# Altium project AD9850模块.PrjPcb
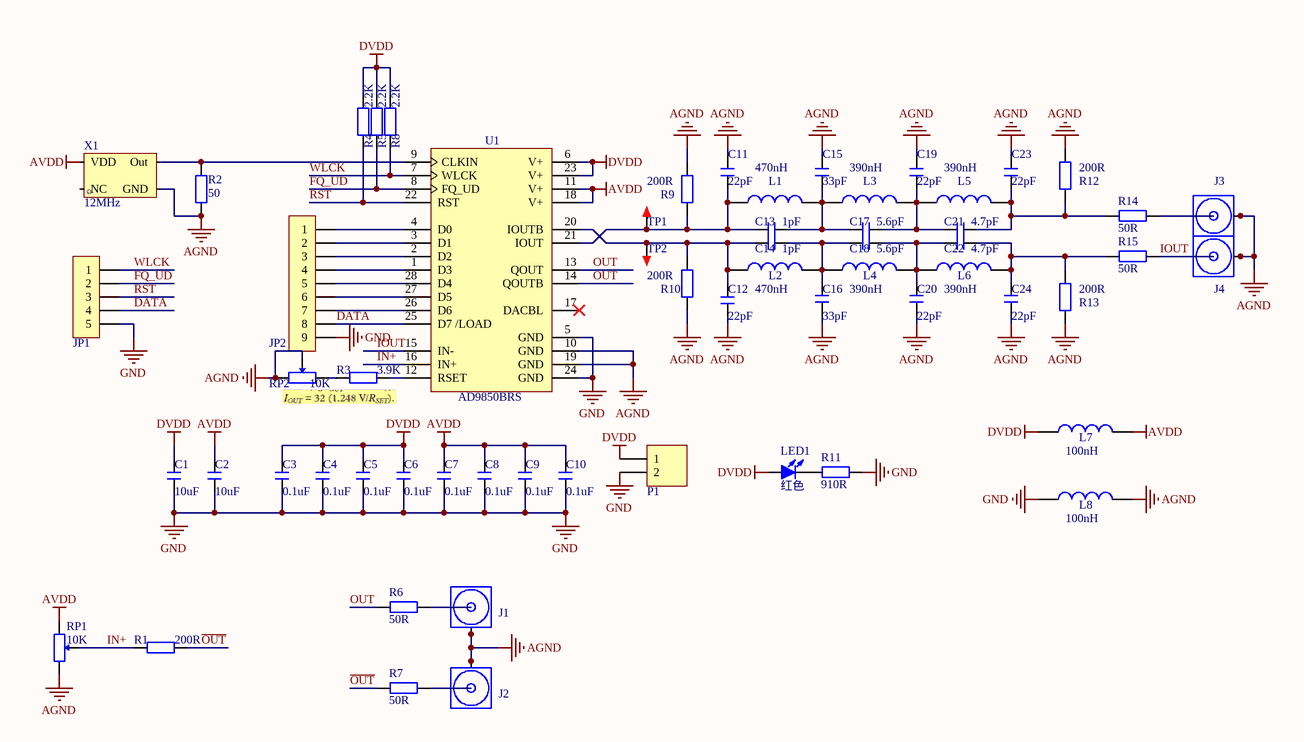
[diagram p0: AD9850模块.SchDoc]
1 sheet, 61 parts. Net scope: global (net labels, ports and power ports of the same name join across sheets).
Board file: AD9850模块.PcbDoc

## Sheet AD9850模块.SchDoc
size A4

### Parts
C1  10uF  [C 0805]
C2  10uF  [C 0805]
C3  0.1uF  [C 0805]
C4  0.1uF  [C 0805]
C5  0.1uF  [C 0805]
C6  0.1uF  [C 0805]
C7  0.1uF  [C 0805]
C8  0.1uF  [C 0805]
C9  0.1uF  [C 0805]
C10  0.1uF  [C 0805]
C11  22pF  [C 0603]
C12  22pF  [C 0603]
C13  1pF  [C 0603]
C14  1pF  [C 0603]
C15  33pF  [C 0603]
C16  33pF  [C 0603]
C17  5.6pF  [C 0603]
C18  5.6pF  [C 0603]
C19  22pF  [C 0603]
C20  22pF  [C 0603]
C21  4.7pF  [C 0603]
C22  4.7pF  [C 0603]
C23  22pF  [C 0603]
C24  22pF  [C 0603]
J1  COAX  [MCX5.08-5-H]  (value not drawn)
J2  COAX  [MCX5.08-5-H]  (value not drawn)
J3  COAX  [MCX5.08-5-H]  (value not drawn)
J4  COAX  [MCX5.08-5-H]  (value not drawn)
JP1  HDR-1X5  [HDR-1X5_H]  (value not drawn)
JP2  HDR-1X9  [HDR-1X9_H]  (value not drawn)
L1  470nH  [L 0603]
L2  470nH  [L 0603]
L3  390nH  [L 0603]
L4  390nH  [L 0603]
L5  390nH  [L 0603]
L6  390nH  [L 0603]
L7  100nH  [L 0603]
L8  100nH  [L 0603]
LED1  红色  [LED 0805G]
P1  Header 2  [HDR2X1_B2]  (value not drawn)
R1  200R  [R 0603]
R2  50  [R 0603]
R3  3.9K  [R 0603]
R4  2.2K  [R 0805]
R5  2.2K  [R 0805]
R6  50R  [R 0603]
R7  50R  [R 0603]
R8  2.2K  [R 0805]
R9  200R  [R 0603]
R10  200R  [R 0603]
R11  910R  [R 0805]
R12  200R  [R 0603]
R13  200R  [R 0603]
R14  50R  [R 0603]
R15  50R  [R 0603]
RP1  10K  [3296W]
RP2  10K  [3296W]
TP1  TEST TP  [TEST TP1.4_B]  (value not drawn)
TP2  TEST TP  [TEST TP1.4_B]  (value not drawn)
U1  AD9850BRS  [RS-28]
X1  Frequency: 12MHz  [X-CPX75]  (hidden comment: XTAL)

### Nets
AGND: C11.2 C12.2 C15.2 C16.2 C19.2 C20.2 C23.2 C24.2 J1.2(GND) J1.3(GND) J1.4(GND) J1.5(GND) J2.2(GND) J2.3(GND) J2.4(GND) J2.5(GND) J3.2(GND) J3.3(GND) J3.4(GND) J3.5(GND) J4.2(GND) J4.3(GND) J4.4(GND) J4.5(GND) L8.2 R2.1 R9.2 R10.1 R12.2 R13.1 RP1.3 RP2.1 RP2.2 U1.10(GND) U1.19(GND) X1.2(GND)
AVDD: C2.2 C7.2 C8.2 C9.2 C10.2 L7.2 RP1.1 U1.11(V+) U1.18(V+) X1.4(VDD)
DVDD: C1.2 C3.2 C4.2 C5.2 C6.2 L7.1 LED1.1(A) P1.1 R4.2 R5.2 R8.2 U1.6(V+) U1.23(V+)
GND: C1.1 C2.1 C3.1 C4.1 C5.1 C6.1 C7.1 C8.1 C9.1 C10.1 JP1.5 JP2.9 L8.1 P1.2 R11.1 U1.5(GND) U1.24(GND)
DATA: JP1.4 JP2.8 U1.25(D7_/LOAD)
FQ_UD: JP1.2 R5.1 U1.8(FQ_UD)
IN+: R1.2 RP1.2 U1.16(IN+)
IOUT: J4.1(Signal) R15.1 U1.15(IN-)
~{OUT}: R1.1 R7.2 U1.14(QOUTB)
OUT: R6.2 U1.13(QOUT)
RST: JP1.3 R4.1 U1.22(RST)
WLCK: JP1.1 R8.1 U1.7(WLCK)
NetC11_1: C11.1 C13.1 L1.1 R9.1 TP1.1 U1.21(IOUT)
NetC12_1: C12.1 C14.2 L2.1 R10.2 TP2.1 U1.20(IOUTB)
NetC13_2: C13.2 C15.1 C17.1 L1.2 L3.1
NetC14_1: C14.1 C16.1 C18.2 L2.2 L4.1
NetC17_2: C17.2 C19.1 C21.1 L3.2 L5.1
NetC18_1: C18.1 C20.1 C22.2 L4.2 L6.1
NetC21_2: C21.2 C23.1 L5.2 R12.1 R14.2
NetC22_1: C22.1 C24.1 L6.2 R13.2 R15.2
NetJ1_1: J1.1(Signal) R6.1
NetJ2_1: J2.1(Signal) R7.1
NetJ3_1: J3.1(Signal) R14.1
NetJP2_1: JP2.1 U1.4(D0)
NetJP2_2: JP2.2 U1.3(D1)
NetJP2_3: JP2.3 U1.2(D2)
NetJP2_4: JP2.4 U1.1(D3)
NetJP2_5: JP2.5 U1.28(D4)
NetJP2_6: JP2.6 U1.27(D5)
NetJP2_7: JP2.7 U1.26(D6)
NetLED1_2: LED1.2(K) R11.2
NetR2_2: R2.2 U1.9(CLKIN) X1.3(Out)
NetR3_1: R3.1 RP2.3
NetR3_2: R3.2 U1.12(RSET)

Not connected (* = marked no-connect by the designer): U1 17(DACBL)*; X1 1(NC)

### Notes on the sheet
- Title
- Size:
- Date:
- A4
- Number:
- Time:
- Revision:
- Sheet
- of
- File:

### Library data of the parts
C1-C24 = C: 无极性贴片电容; 版权归属: 源创客; BOM名称: 无极性贴片电容; 学习资源: www.ooocke.com
JP1 = Header 5: 5P接插件; 版权归属: 源创客; BOM名称: 5P接插件; 学习资源: www.ooocke.com
JP2 = Header 9: 9P接插件; 版权归属: 源创客; BOM名称: 9P接插件; 学习资源: www.ooocke.com
L1-L8 = L: 小功率贴片电感; 版权归属: 源创客; BOM名称: 小功率贴片电感; 学习资源: www.ooocke.com
LED1 = LED-SMD: 贴片LED; 版权归属: 源创客; BOM名称: 贴片LED; 学习资源: www.ooocke.com
P1 = Header 2: 接插件; LatestRevisionDate: 17-Jul-2002; LatestRevisionNote: Re-released for DXP Platform.; Publisher: Altium Limited
R1-R15 = R: 贴片电阻; 版权归属: 源创客; BOM名称: 贴片电阻; 学习资源: www.ooocke.com
RP1 RP2 = RP-ID: 插件单联电位器; BOM名称: 插件电位器; 版权归属: 源创客; 学习资源: www.ooocke.com
TP1 TP2 = TEST TP: 测试环; 版权归属: 源创客; BOM名称: 测试环; 学习资源: www.ooocke.com
U1 = AD9850BRS: CMOS, 125MHz Complete DDS Synthesizer; Note: Pin 17 is unconnected for optimum performance; Published: 8-Jun-2000; LatestRevisionDate: 04-Mar-2005; LatestRevisionNote: Stylized 3D Model Added.; DatasheetVersion: Rev.A 1997; PackageVersion: revA, 1997; PackageReference: RS-28; Publisher: Altium Limited; PackageDescription: SSOP; 28 Leads; Body Width 5.3 mm; Pitch 0.65 mm; ComponentLink1Description: Manufacturer Link; ComponentLink1URL: http://www.analog.com/en/prod/0%2C2877%2CAD9850%2C00.html; ComponentLink2Description: Datasheet; ComponentLink2URL: http://www.analog.com/UploadedFiles/Data_Sheets/34008438159094AD9850_h.pdf
X1 = XTAL_Oscillator: 有源晶振